# EAGLE design bridge_rp_dlp_v3 (EAGLE 9.6.2)
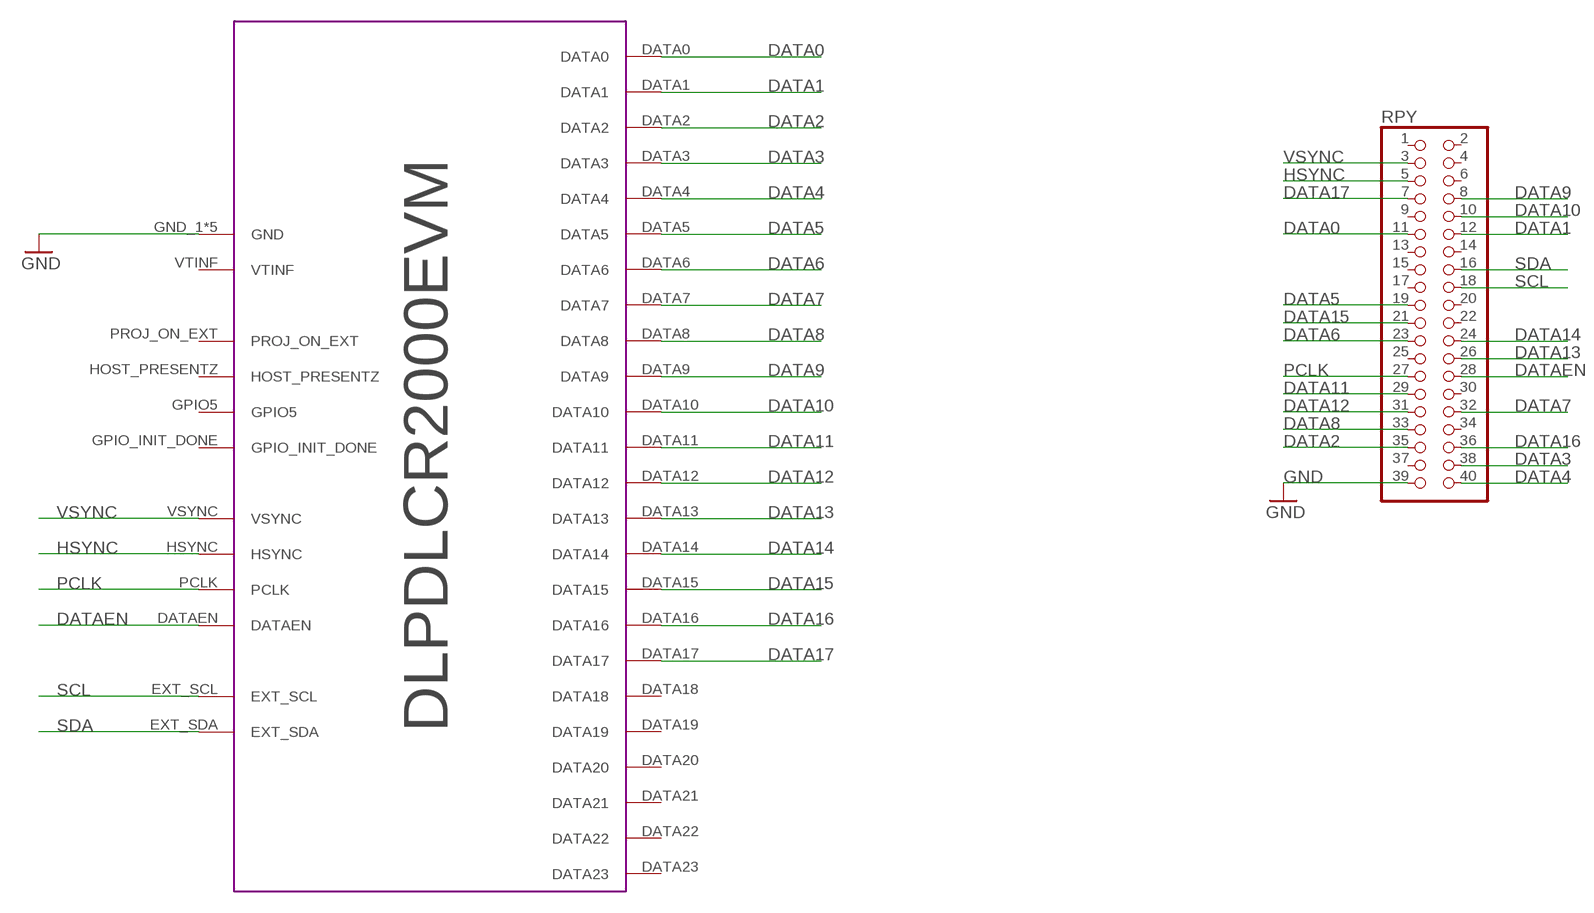
[diagram p0: schematic, sheet 1]

## Parts
RPY  PINHD-2X20  [2X20]
U$1  DLPDLCR2000EVM  [DLPDLCR2000EVM]

## Nets
DATA0: RPY.11 U$1.DATA0
DATA1: RPY.12 U$1.DATA1
DATA2: RPY.35 U$1.DATA2
DATA3: RPY.38 U$1.DATA3
DATA4: RPY.40 U$1.DATA4
DATA5: RPY.19 U$1.DATA5
DATA6: RPY.23 U$1.DATA6
DATA7: RPY.32 U$1.DATA7
DATA8: RPY.33 U$1.DATA8
DATA9: RPY.8 U$1.DATA9
DATA10: RPY.10 U$1.DATA10
DATA11: RPY.29 U$1.DATA11
DATA12: RPY.31 U$1.DATA12
DATA13: RPY.26 U$1.DATA13
DATA14: RPY.24 U$1.DATA14
DATA15: RPY.21 U$1.DATA15
DATA16: RPY.36 U$1.DATA16
DATA17: RPY.7 U$1.DATA17
DATAEN: RPY.28 U$1.DATAEN
GND: RPY.39 U$1.GND_1(GND) U$1.GND_2(GND) U$1.GND_3(GND) U$1.GND_4(GND) U$1.GND_5(GND)
HSYNC: RPY.5 U$1.HSYNC
PCLK: RPY.27 U$1.PCLK
SCL: RPY.18 U$1.EXT_SCL
SDA: RPY.16 U$1.EXT_SDA
VSYNC: RPY.3 U$1.VSYNC
Unconnected: RPY.1 RPY.2 RPY.4 RPY.6 RPY.9 RPY.13 RPY.14 RPY.15 RPY.17 RPY.20 RPY.22 RPY.25 RPY.30 RPY.34 RPY.37 U$1.DATA18 U$1.DATA19 U$1.DATA20 U$1.DATA21 U$1.DATA22 U$1.DATA23 U$1.GPIO5 U$1.GPIO_INIT_DONE U$1.HOST_PRESENTZ U$1.PROJ_ON_EXT U$1.VTINF

## Library data of the parts
RPY = pinhead:PINHD-2X20: PIN HEADER
U$1 = DLP_lib:DLPDLCR2000EVM: The DLP® LightCrafter Display 2000 Evaluation Module (EVM) is the most affordable, compact, plug-and-play DLP display EVM for many ultra-mobile, ultra-portable display applications like mobile projectors, smart home displays, AR glasses, appliances, and robotics. This EVM features the DLP2000 (nHD) chipset, optical engine (which can be purchased separately here), and 8/16/24-bit RGB parallel video processor interface. Visit DLPDLCR230NPEVM for a higher performance EVM option that features 1080p resolution, 100lm, and Raspberry Pi out of the box. https://www.ti.com/tool/DLPDLCR2000EVM

## Board
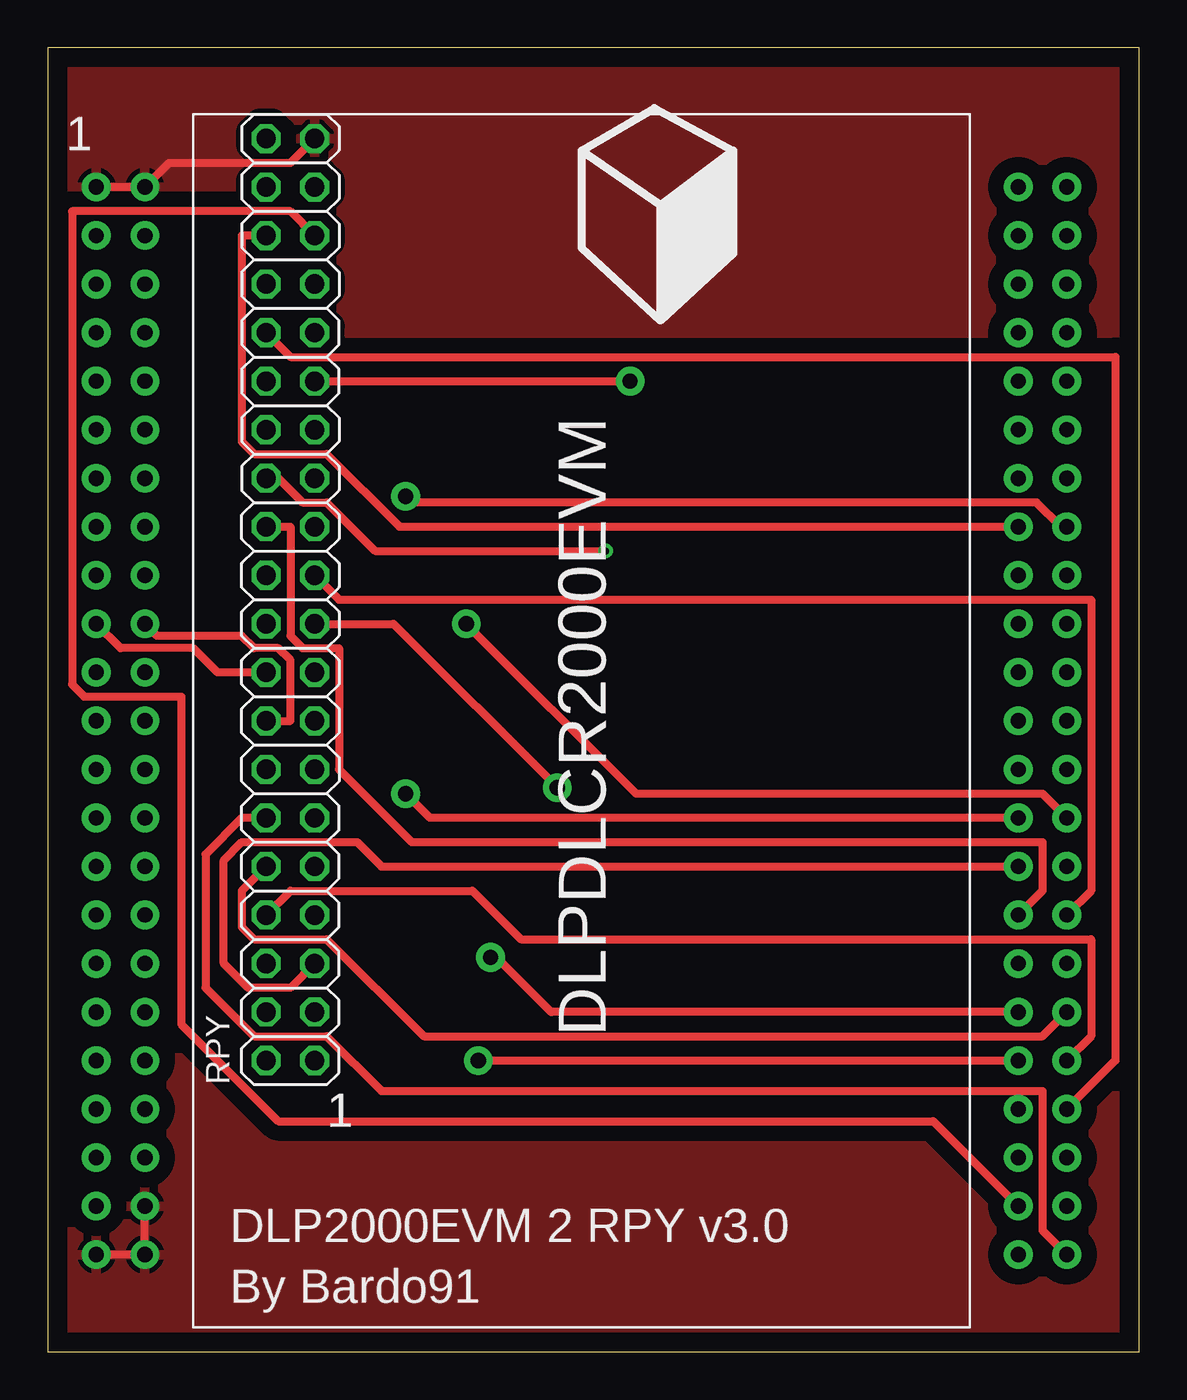
[diagram p1: board, top side]
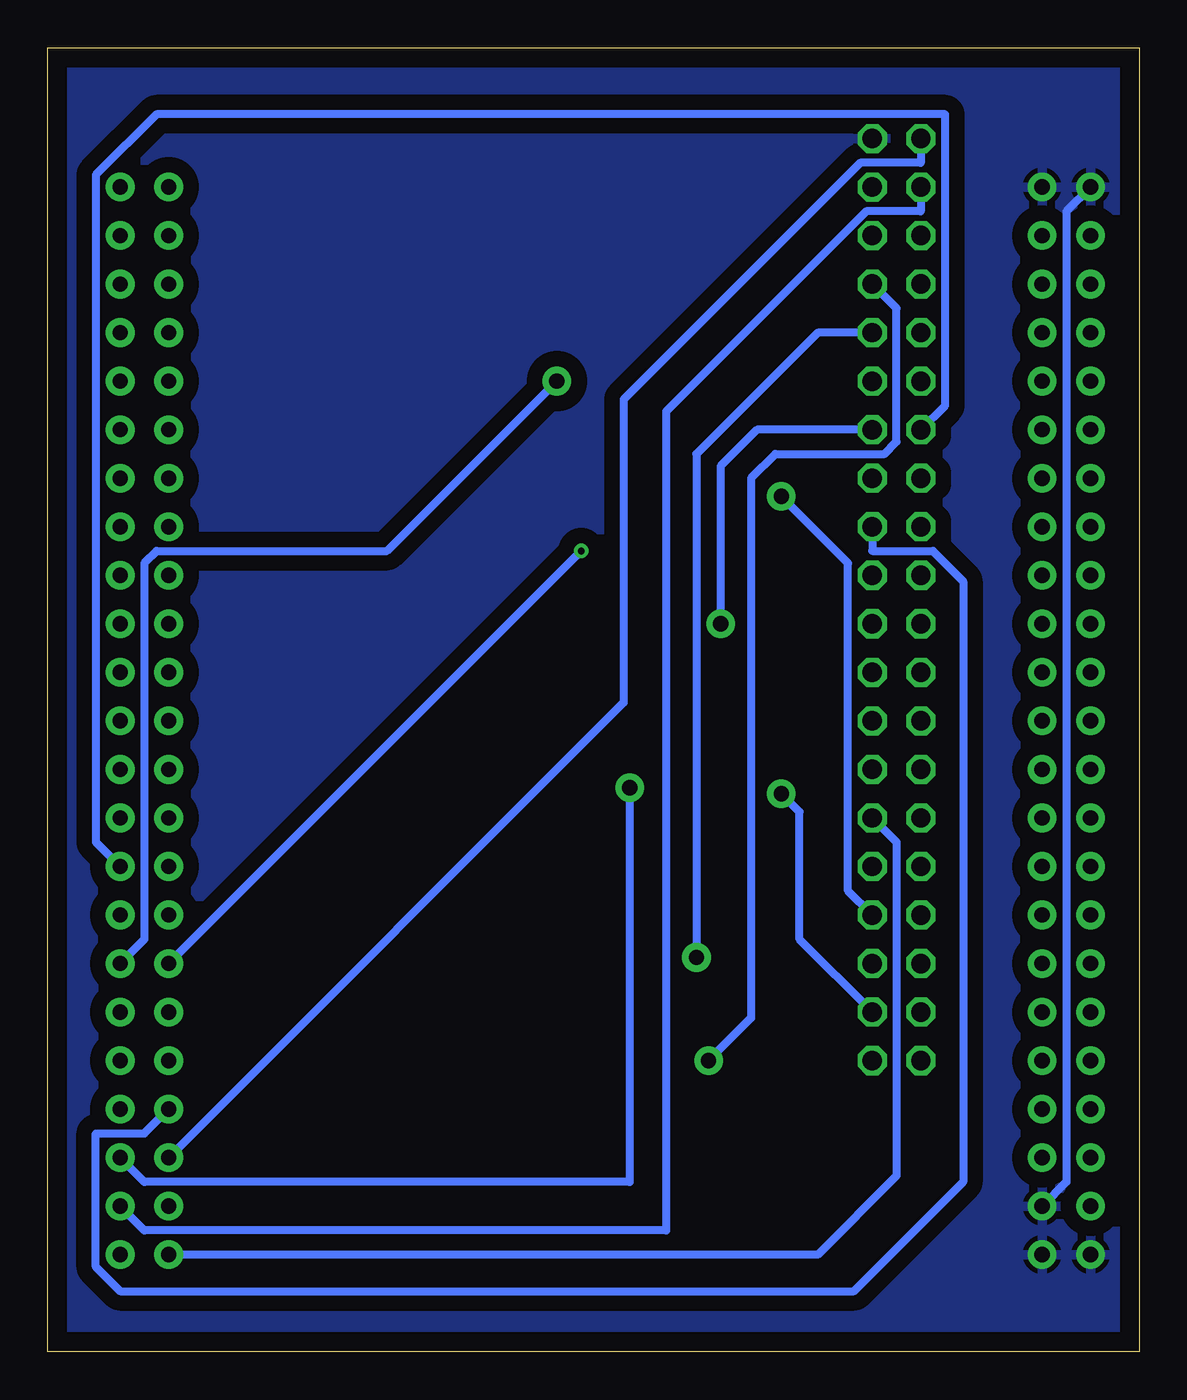
[diagram p2: board, bottom side, seen from below]

Size 57.13 x 68.25 mm. Coordinates in mm from the lower left corner, seen from the top.
Outline: 0,0 57.13,0 57.13,68.25 0,68.25 0,0
Copper layers (1*16): Top 0.035mm / dielectric 1.5mm / Bottom 0.035mm
Design rules "default *": minimum track width 16mil, minimum drill 0.35mm, track to track 6mil, track to pad 6mil, pad to pad 12.5mil, via to via 12.5mil, smd to smd 6mil, copper to edge 40mil, drill to drill 6mil, minimum pad ring 10mil, minimum via ring 8mil, stop-mask expansion 4mil, vias tented up to drill 0mil, thermal gap 10mil

### Footprints (pad centres in the part's own frame; a part is rotated, then mirrored left to right if it is on the bottom)
2X20 = drill 1.016 octagon: 1 -24.13,-1.27; 2 -24.13,1.27; 3 -21.59,-1.27; 4 -21.59,1.27; 5 -19.05,-1.27; 6 -19.05,1.27; 7 -16.51,-1.27; 8 -16.51,1.27; 9 -13.97,-1.27; 10 -13.97,1.27; 11 -11.43,-1.27; 12 -11.43,1.27; 13 -8.89,-1.27; 14 -8.89,1.27; 15 -6.35,-1.27; 16 -6.35,1.27; 17 -3.81,-1.27; 18 -3.81,1.27; 19 -1.27,-1.27; 20 -1.27,1.27; 21 1.27,-1.27; 22 1.27,1.27; 23 3.81,-1.27; 24 3.81,1.27; 25 6.35,-1.27; 26 6.35,1.27; 27 8.89,-1.27; 28 8.89,1.27; 29 11.43,-1.27; 30 11.43,1.27; 31 13.97,-1.27; 32 13.97,1.27; 33 16.51,-1.27; 34 16.51,1.27; 35 19.05,-1.27; 36 19.05,1.27; 37 21.59,-1.27; 38 21.59,1.27; 39 24.13,-1.27; 40 24.13,1.27
DLPDLCR2000EVM = drill 0.8 pad 1.5: DATA0 48.26,-55.88; DATA1 50.8,-55.88; DATA2 48.26,-53.34; DATA3 50.8,-53.34; DATA4 48.26,-50.8; DATA5 50.8,-50.8; DATA6 48.26,-48.26; DATA7 50.8,-48.26; DATA8 48.26,-45.72; DATA9 50.8,-45.72; DATA10 50.8,-43.18; DATA11 50.8,-40.64; DATA12 48.26,-43.18; DATA13 48.26,-40.64; DATA14 48.26,-38.1; DATA15 50.8,-38.1; DATA16 48.26,-17.78; DATA17 50.8,-17.78; DATA18 48.26,-12.7; DATA19 50.8,-12.7; DATA20 48.26,-20.32; DATA21 50.8,-15.24; DATA22 48.26,-15.24; DATA23 48.26,-22.86; DATAEN 50.8,-35.56; EXT_SCL 0,-22.86; EXT_SDA 2.54,-22.86; GND_1 0,0; GND_2 2.54,0; GND_3 2.54,-53.34; GND_4 0,-55.88; GND_5 2.54,-55.88; GPIO5 50.8,-20.32; GPIO_INIT_DONE 50.8,-30.48; HOST_PRESENTZ 0,-53.34; HSYNC 48.26,-35.56; P$4 2.54,-2.54; P$5 0,-5.08; P$6 2.54,-5.08; P$7 0,-7.62; P$8 2.54,-7.62; P$9 0,-10.16; P$10 2.54,-10.16; P$11 0,-12.7; P$12 2.54,-12.7; P$13 0,-15.24; P$14 2.54,-15.24; P$16 2.54,-17.78; P$17 0,-20.32; P$18 2.54,-20.32; P$21 0,-25.4; P$22 2.54,-25.4; P$23 0,-27.94; P$24 2.54,-27.94; P$25 0,-30.48; P$26 2.54,-30.48; P$27 0,-33.02; P$28 2.54,-33.02; P$29 0,-35.56; P$30 2.54,-35.56; P$31 0,-38.1; P$32 2.54,-38.1; P$33 0,-40.64; P$34 2.54,-40.64; P$35 0,-43.18; P$36 2.54,-43.18; P$37 0,-45.72; P$38 2.54,-45.72; P$39 0,-48.26; P$40 2.54,-48.26; P$41 0,-50.8; P$42 2.54,-50.8; P$47 48.26,0; P$48 50.8,0; P$49 48.26,-2.54; P$50 50.8,-2.54; P$51 48.26,-5.08; P$52 50.8,-5.08; P$53 48.26,-7.62; P$54 50.8,-7.62; P$55 48.26,-10.16; P$56 50.8,-10.16; P$66 50.8,-22.86; P$67 48.26,-25.4; P$68 50.8,-25.4; P$69 48.26,-27.94; P$70 50.8,-27.94; P$71 48.26,-30.48; PCLK 50.8,-33.02; PROJ_ON_EXT 0,-17.78; VSYNC 48.26,-33.02; VTINF 0,-2.54

### Placement (x,y rotation side)
RPY  12.7,39.37 90 top
U$1  2.54,60.96 0 top

### Tracks (layer width: path | path; a pad name or v marks a point on that pad's centre or on a via)
DATA0
  Bottom 0.406: U$1.DATA0 16.83,5.08 12.7,9.21 12.7,26.67 RPY.11
DATA1
  Top 0.406: U$1.DATA1 52.07,6.35 52.07,13.65 17.46,13.65 14.61,16.51 10.79,16.51 8.26,19.05 8.26,26.04 10.16,27.94 RPY.12
DATA2
  Top 0.406: U$1.DATA2 46.35,12.06 12.06,12.06 6.99,17.14 6.99,34.29 1.91,34.29 1.27,34.92 1.27,59.69 12.7,59.69 RPY.35
DATA3
  Bottom 0.406: U$1.DATA3 52.07,6.35 24.77,6.35 24.77,49.21 14.29,59.69 11.43,59.69 RPY.38
DATA4
  Bottom 0.406: U$1.DATA4 26.99,33.97 26.99,49.85 14.61,62.23 11.43,62.23 RPY.40
DATA5  (via drill 0.8 pad 1.5)
  Top 0.406: v26.67,29.53 18.1,38.1 RPY.19
  Bottom 0.406: U$1.DATA5 52.07,8.89 26.67,8.89 v26.67,29.53
DATA6
  Bottom 0.406: U$1.DATA6 52.07,11.43 54.61,11.43 54.61,4.45 53.34,3.17 14.92,3.17 9.21,8.89 9.21,40.32 10.79,41.91 13.97,41.91 RPY.23
DATA7
  Top 0.406: U$1.DATA7 55.88,15.24 55.88,52.07 12.7,52.07 RPY.32
DATA8  (via drill 0.8 pad 1.5)
  Top 0.406: v22.54,15.24 U$1.DATA8
  Bottom 0.406: v22.54,15.24 20.32,17.46 20.32,45.72 19.05,46.99 13.34,46.99 12.7,47.62 12.7,54.61 RPY.33
DATA9
  Top 0.406: U$1.DATA9 54.61,16.51 54.61,21.59 24.77,21.59 22.23,24.13 12.7,24.13 RPY.8
DATA10
  Top 0.406: U$1.DATA10 52.07,16.51 19.68,16.51 14.61,21.59 10.79,21.59 10.16,22.23 10.16,24.13 RPY.10
DATA11  (via drill 0.8 pad 1.5)
  Top 0.406: RPY.29 v30.48,50.8
  Bottom 0.406: U$1.DATA11 52.07,21.59 52.07,41.27 51.44,41.91 39.37,41.91 v30.48,50.8
DATA12  (via drill 0.8 pad 1.5)
  Top 0.406: v23.18,20.64 23.5,20.64 26.35,17.78 U$1.DATA12
  Bottom 0.406: v23.18,20.64 23.18,46.99 16.83,53.34 RPY.31
DATA13  (via drill 0.35)
  Top 0.406: v29.21,41.91 17.14,41.91 14.61,44.45 13.34,44.45 12.06,45.72 RPY.26
  Bottom 0.406: v29.21,41.91 U$1.DATA13
DATA14
  Top 0.406: U$1.DATA14 52.07,24.13 52.07,26.67 19.05,26.67 15.24,30.48 15.24,36.83 13.34,36.83 12.7,37.47 12.7,43.18 RPY.24
DATA15
  Top 0.406: U$1.DATA15 54.61,24.13 54.61,39.37 15.24,39.37 RPY.21
DATA16
  Top 0.406: U$1.DATA16 18.41,43.18 14.61,46.99 10.79,46.99 10.16,47.62 10.16,58.42 RPY.36
DATA17  (via drill 0.8 pad 1.5)
  Top 0.406: U$1.DATA17 53.02,43.18 51.75,44.45 19.05,44.45 v18.73,44.77
  Bottom 0.406: v18.73,44.77 15.24,41.27 15.24,24.13 RPY.7
DATAEN
  Bottom 0.406: U$1.DATAEN 54.61,26.67 54.61,61.59 51.44,64.77 10.16,64.77 10.16,49.53 RPY.28
GND
  Top 0.406: U$1.GND_4 U$1.GND_5 U$1.GND_3 | U$1.GND_1 U$1.GND_2 6.35,62.23 12.7,62.23 RPY.39
  Bottom 0.406: U$1.GND_3 3.81,8.89 3.81,59.69 U$1.GND_1
  pour Top (isolate 0.813): 0.32,67.94 56.83,67.94 56.83,0.32 0.32,0.32
  pour Bottom (isolate 0.813): 0.32,67.94 56.83,67.94 56.83,0.32 0.32,0.32
HSYNC
  Top 0.406: U$1.HSYNC 17.46,25.4 16.19,26.67 10.16,26.67 9.21,25.72 9.21,20.32 10.48,19.05 12.7,19.05 RPY.5
PCLK  (via drill 0.8 pad 1.5)
  Top 0.406: U$1.PCLK 52.07,29.21 30.8,29.21 v21.91,38.1
  Bottom 0.406: v21.91,38.1 21.91,46.35 20,48.26 RPY.27
SCL
  Top 0.406: U$1.EXT_SCL 3.81,36.83 7.62,36.83 8.89,35.56 RPY.18
SDA
  Top 0.406: U$1.EXT_SDA 5.71,37.47 10.16,37.47 10.79,36.83 12.06,36.83 12.7,36.2 12.7,33.02 RPY.16
VSYNC  (via drill 0.8 pad 1.5)
  Top 0.406: U$1.VSYNC 20,27.94 v18.73,29.21
  Bottom 0.406: v18.73,29.21 17.78,28.26 17.78,21.59 RPY.3

### Text on the board
tNames: 1 | 1 | DLP2000EVM 2 RPY v3.0 | By Bardo91